# Altium schematic sheet Sheet1.SchDoc
size 431 x 279 mm; SheetNumber: 1; SheetTotal: 1; ENG_APP_DATE: --/--/--; DSN_APP_DATE: --/--/--; CHK_APP_DATE: --/--/--
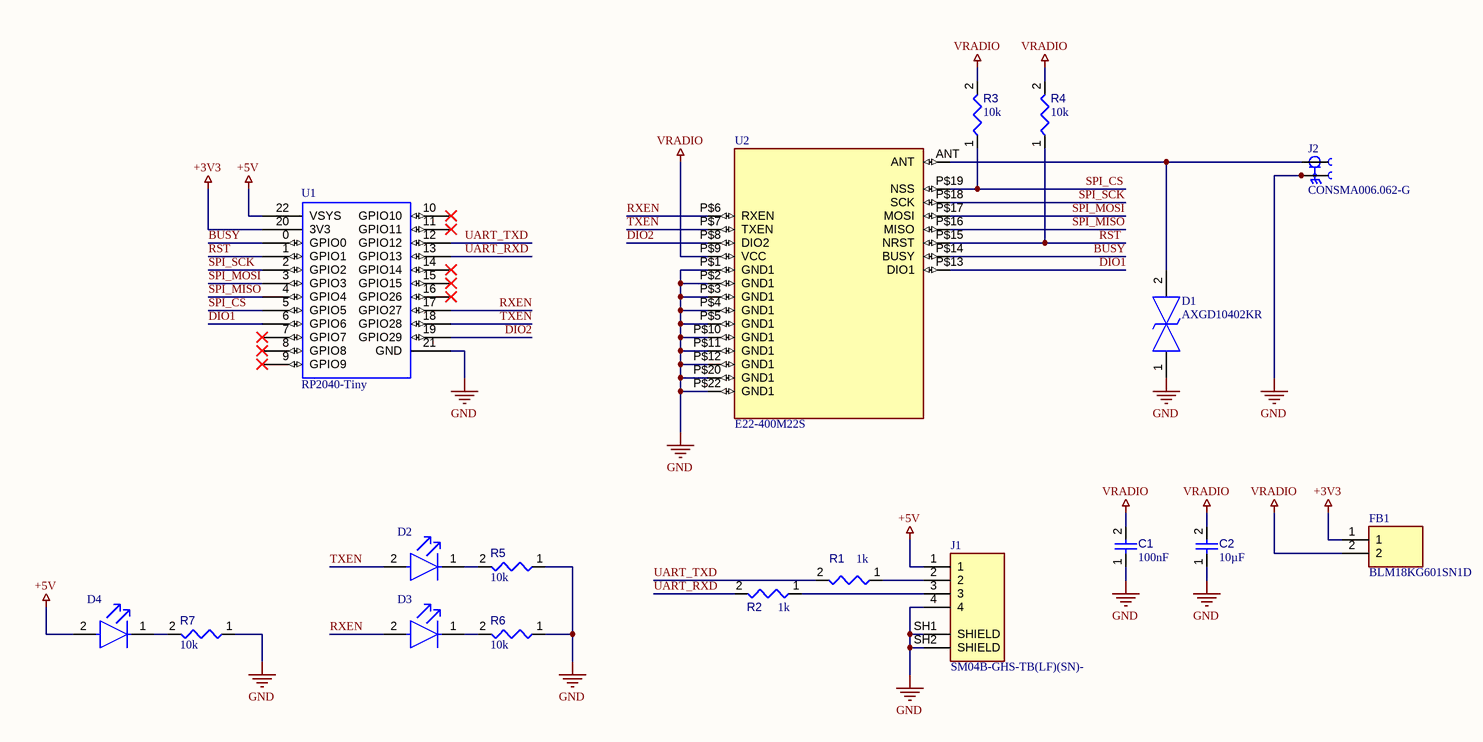
[diagram p0: Sheet1.SchDoc]

## Parts
C1  value 100nF  [CAPC0402(1005)60_L]  (hidden comment: Capacitor 100nF +/-20% 10V 0402)
C2  value 10µF  [CAPC0603(1608)100_L]  (hidden comment: Capacitor 10µF +/-20% 10V 0603)
D1  AXGD10402KR  [DIONM105X51N]
D2  (no value)  [FP-LTST-C191TBKT-MFG]
D3  (no value)  [FP-LTST-C191TBKT-MFG]
D4  (no value)  [FP-LTST-C191TBKT-MFG]
FB1  BLM18KG601SN1D  [BLM18EG121SH1D]
J1  SM04B-GHS-TB(LF)(SN)-  [JST_SM04B-GHS-TB(LF)(SN)-]
J2  CONSMA006.062-G  [LINX_CONSMA006.062-G]
R1  value 1k  [RESC0402(1005)_L]  (hidden comment: Resistor 1K +/-5 % 0402 63 mW)
R2  value 1k  [RESC0402(1005)_L]  (hidden comment: Resistor 1K +/-5 % 0402 63 mW)
R3  value 10k  [RESC0402(1005)_L]  (hidden comment: Resistor 10K  +/-1 % 0402 63 mW)
R4  value 10k  [RESC0402(1005)_L]  (hidden comment: Resistor 10K  +/-1 % 0402 63 mW)
R5  value 10k  [RESC0402(1005)_L]  (hidden comment: Resistor 10K  +/-1 % 0402 63 mW)
R6  value 10k  [RESC0402(1005)_L]  (hidden comment: Resistor 10K  +/-1 % 0402 63 mW)
R7  value 10k  [RESC0402(1005)_L]  (hidden comment: Resistor 10K  +/-1 % 0402 63 mW)
U1  RP2040-Tiny  [RP2040-Tiny-Footprint-1]
U2  E22-400M22S  [E22-900M22S]

## Nets
+3V3: FB1.1 U1.20(3V3)
+5V: D4.2(A) J1.1 U1.22(VSYS)
GND: C1.1 C2.1 D1.1 J1.4 J1.SH1(SHIELD) J1.SH2(SHIELD) J2.S1 J2.S2 J2.S3 J2.S4 R5.1 R6.1 R7.1 U1.21(GND) U2.P$1(GND1) U2.P$2(GND1) U2.P$3(GND1) U2.P$4(GND1) U2.P$5(GND1) U2.P$10(GND1) U2.P$11(GND1) U2.P$12(GND1) U2.P$20(GND1) U2.P$22(GND1)
VRADIO: C1.2 C2.2 FB1.2 R3.2 R4.2 U2.P$9(VCC)
BUSY: U1.0(GPIO0) U2.P$14(BUSY)
DIO1: U1.6(GPIO6) U2.P$13(DIO1)
DIO2: U1.19(GPIO29) U2.P$8(DIO2)
RST: R4.1 U1.1(GPIO1) U2.P$15(NRST)
RXEN: D3.2(A) U1.17(GPIO27) U2.P$6(RXEN)
SPI_CS: R3.1 U1.5(GPIO5) U2.P$19(NSS)
SPI_MISO: U1.4(GPIO4) U2.P$16(MISO)
SPI_MOSI: U1.3(GPIO3) U2.P$17(MOSI)
SPI_SCK: U1.2(GPIO2) U2.P$18(SCK)
TXEN: D2.2(A) U1.18(GPIO28) U2.P$7(TXEN)
UART_RXD: R2.2 U1.13(GPIO13)
UART_TXD: R1.2 U1.12(GPIO12)
NetD1_2: D1.2 J2.1 U2.ANT
NetD2_1: D2.1(C) R5.2
NetD3_1: D3.1(C) R6.2
NetD4_1: D4.1(C) R7.2
NetJ1_2: J1.2 R1.1
NetJ1_3: J1.3 R2.1

Not connected (* = marked no-connect by the designer): U1 7(GPIO7)* 8(GPIO8)* 9(GPIO9)* 10(GPIO10)* 11(GPIO11)* 14(GPIO14)* 15(GPIO15)* 16(GPIO26)*

## Notes on the sheet
- DWG. NO.
- REV.
- SHT.
- THIS DOCUMENT AND THE DATA DISCLOSED HEREIN OR HEREWITH IS THE PROPERTY OF ALTIUM LIMITED AND MAY BE FREELY DISTRIBUTED IN WHOLE. NO RIGHTS ARE RESERVED OR EXPRESS OR IMPLIED WARANTEE GIVEN.
- REVISION
- DESCRIPTION
- DATE
- APPROVED
- ENG:
- APPROVALS
- PROJECT
- DSN:
- CHK:
- REFERENCE DOCUMENTS
- PROJECT REVISION:
- TITLE
- DOCUMENT REVISION:
- DESIGN ITEM:
- BOM:
- FAB DWG:
- PCB DWG:
- ASSY DWG:
- SCALE:
- SIZE
- B
- CAGE CODE
- FILE NAME
- DWG NO.
- SHEET
- OF
- REV

## Library data of the parts
C1 = CMP-001-00061-3: Chip Capacitor, 100nF +/-20%, 10V, 0402, Thickness 0.6 mm; Tolerance: 20%; Mounting Technology: SMT; Voltage Rating: 10V; Max Operating Temperature: 85°C; Pins: 2; Case/Package: 0402; Min Operating Temperature: -55°C
C2 = CMP-001-00075-4: Chip Capacitor, 10µF +/-20%, 10V, 0603, Thickness 1 mm; Tolerance: 10%; Voltage Rating: 10V; Max Operating Temperature: 85°C; Pins: 2; Case/Package: 0603; Mounting Technology: SMT; Min Operating Temperature: -55°C
D1 = AXGD10402KR: TVS Diode (Bi-directional); Manufacturer_Name: LITTELFUSE; Datasheet Link: https://www.littelfuse.com/~/media/electronics/datasheets/polymer_esd_suppressors/littelfuse_xtremeguard_axgd_datasheet.pdf.pdf; Height: 0.51mm; Manufacturer_Part_Number: AXGD10402KR; Mouser Part Number: 576-AXGD10402KR; Mouser Price/Stock: https://www.mouser.co.uk/ProductDetail/Littelfuse/AXGD10402KR?qs=%252BdQmOuGyFcFxx0p0UGW3NA%3D%3D; Arrow Part Number: AXGD10402KR; Arrow Price/Stock: https://www.arrow.com/en/products/axgd10402kr/littelfuse?region=nac
D2-D4 = CMP-22017-000008-1: LED BLUE CLEAR CHIP SMD; Lens Color: Colorless; Dominant Wavelength: 475nm; Forward Current: 20mA; Wavelength: 468nm; Viewing Angle: 130°; Power Dissipation: 76mW; Luminous Intensity: 180mcd; Reverse Voltage: 5V; Number of Elements: 1; Lens Style: Diffused; Forward Voltage: 3.8V; Max Power Dissipation: 75mW; Case Code (Metric): 1608; Packaging: Tape and Reel; Case/Package: 0603; Depth: 1.6mm; Mount: Surface Mount; Lead Free: Lead Free; Min Operating Temperature: -20°C; Lens Transparency: Clear; Illumination Color: Blue; Height: 0.55mm; Test Current: 20mA; Case Code (Imperial): 0603; Max Operating Temperature: 80°C; Number of Pins: 2; Length: 0.8mm; Radiation Hardening: No; Package Quantity: 1; Number of LEDs: 1; Width: 0.8mm; Color: Blue
FB1 = BLM18KG601SN1D: Ferrite Bead; Manufacturer_Name: Murata Electronics; Datasheet Link: http://www.murata.com/~/media/webrenewal/support/library/catalog/products/emc/emifil/c31e.ashx?la=en-gb; Height: 0.95mm; Manufacturer_Part_Number: BLM18KG601SN1D; Mouser Part Number: 81-BLM18KG601SN1D; Mouser Price/Stock: https://www.mouser.co.uk/ProductDetail/Murata-Electronics/BLM18KG601SN1D?qs=rvfpa0%252BU10NPWIt745bDHg%3D%3D; Arrow Part Number: BLM18KG601SN1D; Arrow Price/Stock: https://www.arrow.com/en/products/blm18kg601sn1d/murata-manufacturing?region=nac
J1 = SM04B-GHS-TB(LF)(SN)-: Conn Header Gh Side 4pos 1.25mm; MF: {'manufacturer': u'JST Sales'}; Package: None; Price: None; Value: *; MP: SM04B-GHS-TB(LF)(SN)-; Availability: Unavailable
J2 = CONSMA006.062-G: SMA FEMALE EDGE MULTI-MOUNT FOR 0.062" THICK BOARD; MF: {'manufacturer': u'TE Connectivity / Linx Technologies'}; Package: None; Price: None; Value: *; MP: CONSMA006.062-G; Availability: Unavailable
R1 R2 = CMP-009-00157-3: Chip Resistor, 1 kOhms, +/-5 %, 63 mW, -55 to 155 degC, 0402; Tolerance: 5%; Power: 63mW; Case/Package: 0402; Pins: 2; Min Operating Temperature: -55°C; Max Operating Temperature: 155°C
R3-R7 = CMP-009-00149-3: Chip Resistor, 10 kOhms, +/-1 %, 63 mW, -55 to 125 degC, 0402; Power: 63mW; Tolerance: 1%; Min Operating Temperature: -55°C; Case/Package: 0402; Max Operating Temperature: 155°C; Pins: 2
U1 = CMP-020-00026-3
U2 = CMP-002-000420-2: SX1262 868/915MHz SPI SMD LoRa Module; MF: EBYTE; Value: *; Check_prices: https://www.snapeda.com/parts/E22-900M22S/EBYTE/view-part/5137737/?ref=eda; Design Item ID: E22-900M22S; Availability: Unavailable; Package: Package; Pin Count: 22; SnapEDA_Link: https://www.snapeda.com/parts/E22-900M22S/EBYTE/view-part/5137737/?ref=snap; Component Type: Standard; Source: E22-900M22S.SchLib; MP: E22-900M22S; Price: None